# Altium schematic sheet MICROSD.SchDoc
size A4; SheetNumber: 5; SheetTotal: 6
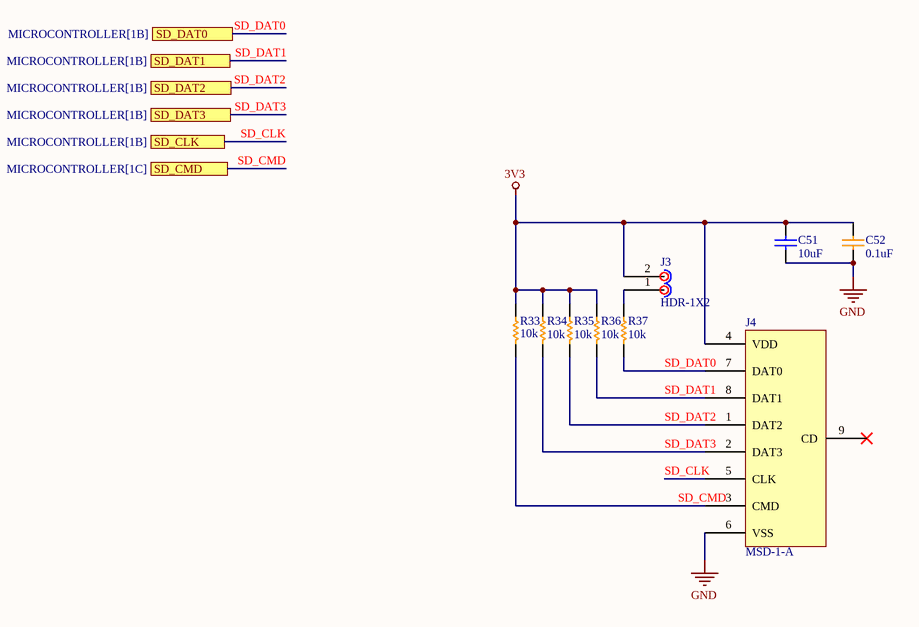
[diagram p0: MICROSD.SchDoc]

## Parts
C51  10uF  [CAP-0805]
C52  0.1uF  [CAP-0603]
J3  HDR-1X2  [HDR-1X2]
J4  MSD-1-A  [MSD-1-A]
R33  10k  [RES-0603]
R34  10k  [RES-0603]
R35  10k  [RES-0603]
R36  10k  [RES-0603]
R37  10k  [RES-0603]

## Ports
SD_CLK (see MICROCONTROLLER[1B]), SD_CMD (see MICROCONTROLLER[1C]), SD_DAT0 (see MICROCONTROLLER[1B]), SD_DAT1 (see MICROCONTROLLER[1B]), SD_DAT2 (see MICROCONTROLLER[1B]), SD_DAT3 (see MICROCONTROLLER[1B])

## Nets
3V3: C51.2 C52.2 J3.2 J4.4(VDD) R33.2 R34.2 R35.2 R36.2
GND: C51.1 C52.1 J4.6(VSS)
SD_CLK: J4.5(CLK) ; port SD_CLK
SD_CMD: J4.3(CMD) R33.1 ; port SD_CMD
SD_DAT0: J4.7(DAT0) R37.1 ; port SD_DAT0
SD_DAT1: J4.8(DAT1) R36.1 ; port SD_DAT1
SD_DAT2: J4.1(DAT2) R35.1 ; port SD_DAT2
SD_DAT3: J4.2(DAT3) R34.1 ; port SD_DAT3
NetJ3_1: J3.1 R37.2

Not connected (* = marked no-connect by the designer): J4 9(CD)*

## Library data of the parts
C51 = CAP-0805: CAP CER 22UF 10V X5R 0805
C52 = CAP-0603: CAP CER 0.1UF 10V X7R 0603
J4 = MSD-1-A: CONN MICROSD CARD R/A SMD
R33-R37 = RES-0603: RES SMD 10K OHM 1% 1/10W 0603